# Altium schematic sheet BUZZER.SchDoc
size A4
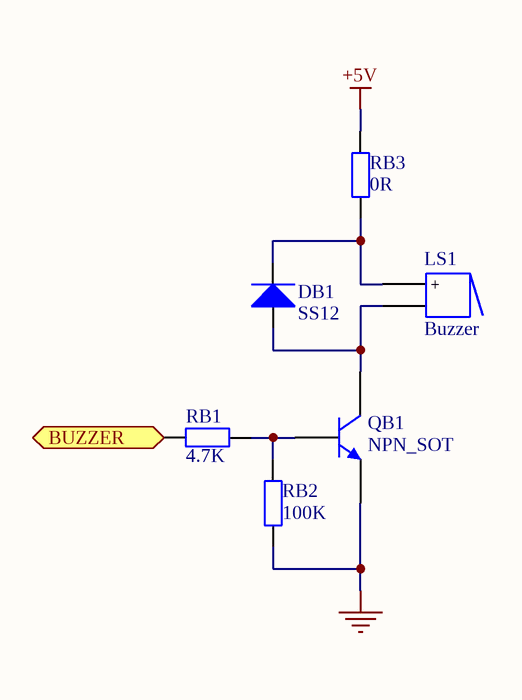
[diagram p0: BUZZER.SchDoc]

## Parts
DB1  SMA: SS12  [DO-214AC]  (hidden comment: Diode)
LS1  Buzzer  [Buzzer 5]
QB1  NPN_SOT  [SOT23_N]
RB1  value 4.7K  [RESC1608N]  (hidden comment: Res1)
RB2  value 100K  [RESC1608N]  (hidden comment: Res1)
RB3  value 0R  [RESC1608N]  (hidden comment: Res1)

## Ports
BUZZER (in)

## Nets
+5V: RB3.2
GND: QB1.2(E) RB2.2
BUZZER: RB1.2 ; port BUZZER
NetDB1_1: DB1.1(A) LS1.2 QB1.1(C)
NetDB1_2: DB1.2(K) LS1.1(+) RB3.1
NetQB1_3: QB1.3(B) RB1.1 RB2.1

## Library data of the parts
LS1 = Buzzer: Magnetic Transducer Buzzer; Published: 24-Mar-1999; LatestRevisionDate: 17-Dec-2003; LatestRevisionNote: Schematic revised, PCB Footprint replaced.; DatasheetVersion: 17-Dec-2003; PackageReference: ABSM-1574; Publisher: Altium Limited; PackageDescription: Magnetic Transducer Buzzer; ComponentLink1Description: Manufacturer Link; ComponentLink1URL: http://www.megastar.com/linecard/buzzmode/index.php
QB1 = NPN_SOT: NPN Bipolar Transistor; Published: 8-Jun-2000; LatestRevisionDate: 17-Jul-2002; LatestRevisionNote: Re-released for DXP Platform.; PackageReference: TO-226-AA; Publisher: Altium Limited; PackageDescription: TO, Flat Index; 3 In-Line, Axial Leads; Body Dia. 4.8mm; Leads 0.55 x 0.51 mm (max); Code_JEDEC: TO-226-AA
RB1-RB3 = Res1: Resistor; Published: 8-Jun-2000; LatestRevisionDate: 17-Jul-2002; LatestRevisionNote: Re-released for DXP Platform.; PackageReference: AXIAL-0.4; Publisher: Altium Limited